# EasyEDA schematic easyeda_source_code.json
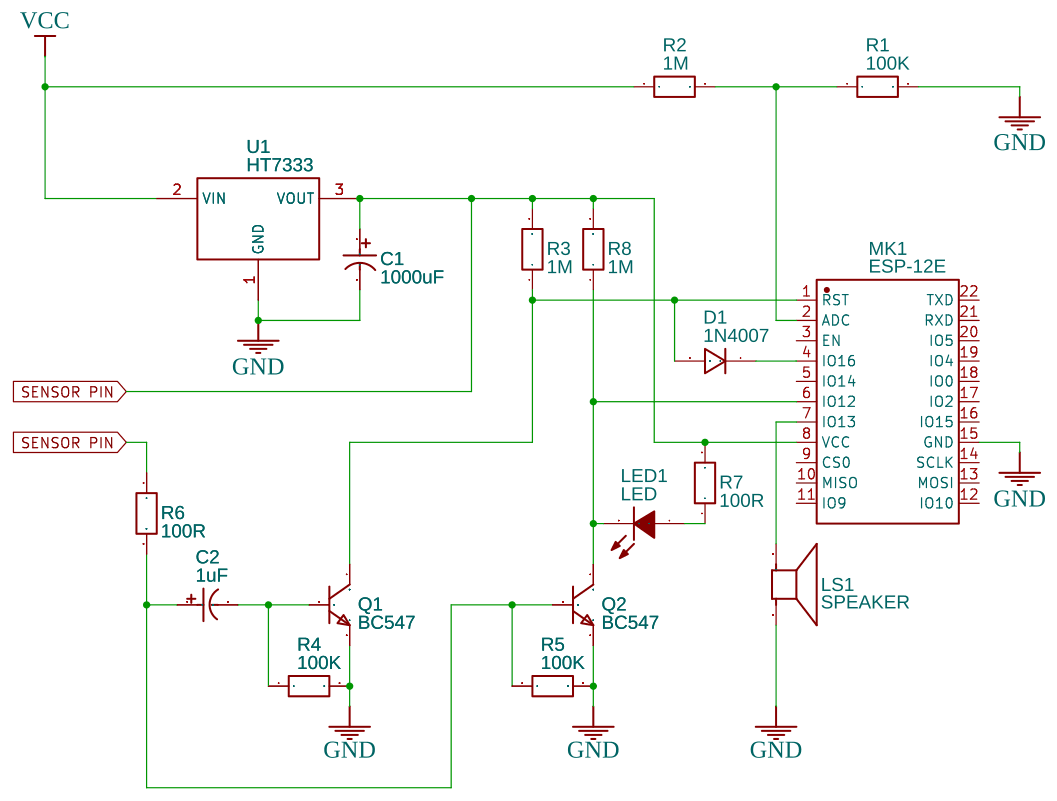
[diagram p0: schematic sheet]

## Parts
C1  1000uF  [CAP-TH_BD10.0-P5.00-D1.0-FD]
C2  1uF  [CAP-TH_BD10.0-P5.00-D1.0-FD]
D1  1N4007  [SOD-123_L2.8-W1.8-LS3.7-RD]
LED1  LED  [LED0603_RED]
LS1  SPEAKER  [PS12]
MK1  ESP-12E  [WIFIM-SMD_ESP-12E]
Q1  BC547  [TO-92-3_L4.8-W3.7-P2.54-L]
Q2  BC547  [TO-92-3_L4.8-W3.7-P2.54-L]
R1  100K  [R0201]
R2  1M  [R0201]
R3  1M  [R0201]
R4  100K  [R0201]
R5  100K  [R0201]
R6  100R  [R0201]
R7  100R  [R0201]
R8  1M  [R0201]
U1  HT7333  [TO-92-3_L5.1-W4.1-P1.27-L]

## Library data of the parts
C1 C2 = 1000uF 10V 10*15: Supplier: LCSC; Manufacturer: ValuePro; Manufacturer Part: 1000uF 10V绿金 10*15; Supplier Part: C43339
D1 = 1N4007W: Supplier: LCSC; Supplier Part: C328592; Manufacturer: BLUE ROCKET; Contributor: LCEDA_Lib
LED1 = LED-0603_R: Manufacturer: EVERLIGHT(台湾亿光); Manufacturer Part: 19-217/R6C-AL1M2VY/3T; Supplier Part: C72044; Supplier: LCSC; Contributor: LCEDA_01
LS1 = SPEAKERPS12: SPEAKER Source: BuerklinAdded PS12 (for part # PS1240 piezo) http:www.ladyada.netlibrarypcbeaglelibrary.html; Contributor: Adafruit
MK1 = ESP-12E: Supplier: LCSC; Manufacturer: Ai-Thinker; Supplier Part: C89297
Q1 Q2 = BC547BTA: Supplier: LCSC; Supplier Part: C258144; Manufacturer: ON Semicon; Contributor: LCSC
R1-R8 = R_0201_EU: Contributor: LCEDA_Lib
U1 = HT7333-A_C73726: Supplier: LCSC; Supplier Part: C73726; Manufacturer: Holtek Semicon; Manufacturer Part: HT7333-A; Contributor: LCSC

## Nets
GND: C1.2 LS1.P$2(-) MK1.15(GND) Q1.3(E) Q2.3(E) R1.2 R4.2 R5.2 U1.1(GND)
VCC: R2.1 U1.2(VIN)
SENSOR PIN: C1.1 MK1.8(VCC) R3.2 R6.1 R7.2 R8.2 U1.3(VOUT)
Net-(C2-1): C2.1 Q2.2(B) R5.1 R6.2
Net-(C2-2): C2.2 Q1.2(B) R4.1
Net-(D1-1): D1.1 MK1.4(IO16)
Net-(D1-2): D1.2 MK1.1(RST) Q1.1(C) R3.1
Net-(LED1-1): LED1.1 R7.1
Net-(LED1-2): LED1.2 MK1.6(IO12) Q2.1(C) R8.1
Net-(LS1-P$1): LS1.P$1(+) MK1.7(IO13)
Net-(MK1-2): MK1.2(ADC) R1.1 R2.2

Not connected (* = marked no-connect by the designer): MK1 3(EN) 5(IO14) 9(CS0) 10(MISO) 11(IO9) 12(IO10) 13(MOSI) 14(SCLK) 16(IO15) 17(IO2) 18(IO0) 19(IO4) 20(IO5) 21(RXD) 22(TXD)
